# Altium schematic sheet 0150_PD TEST POINTS.SchDoc
size 848 x 558 mm
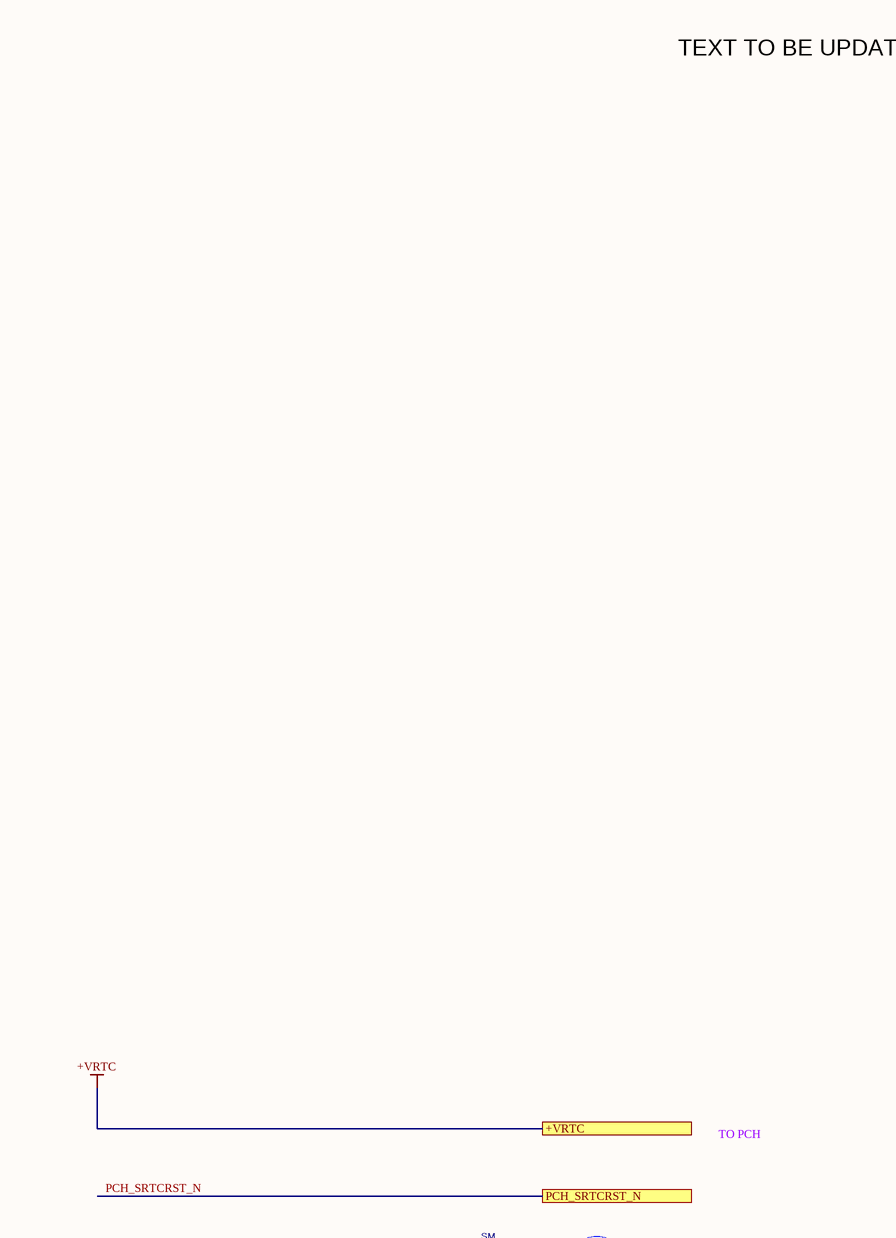
[diagram p0: 0150_PD TEST POINTS.SchDoc, top left]
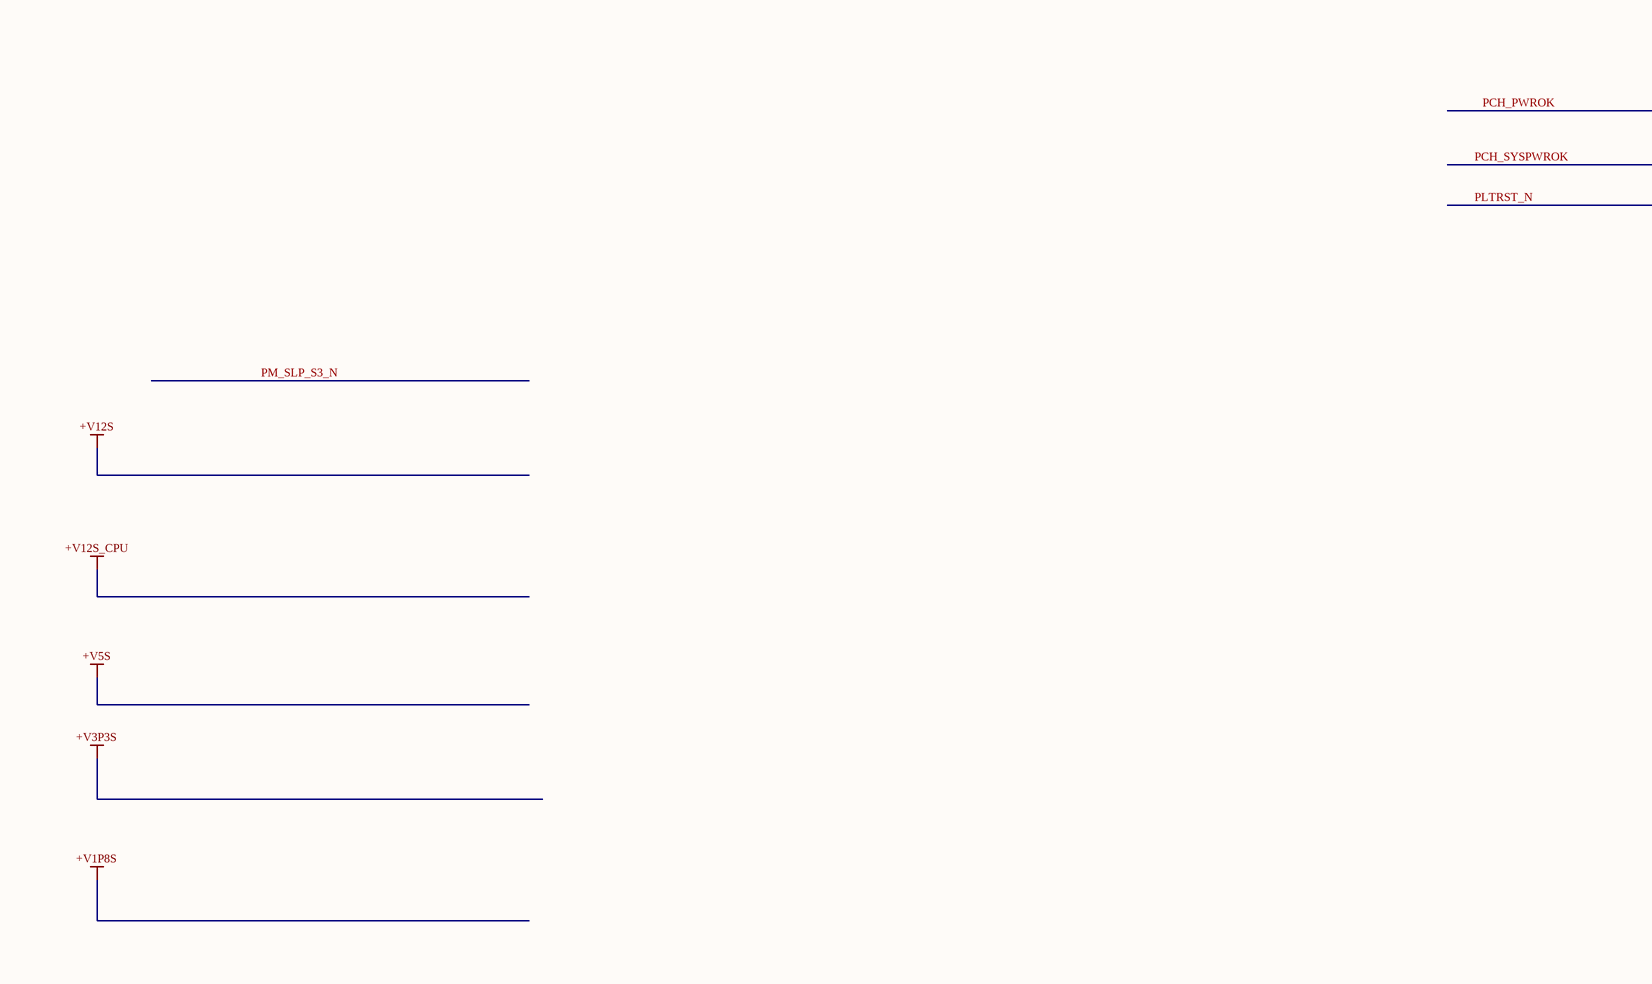
[diagram p1: 0150_PD TEST POINTS.SchDoc, top right]
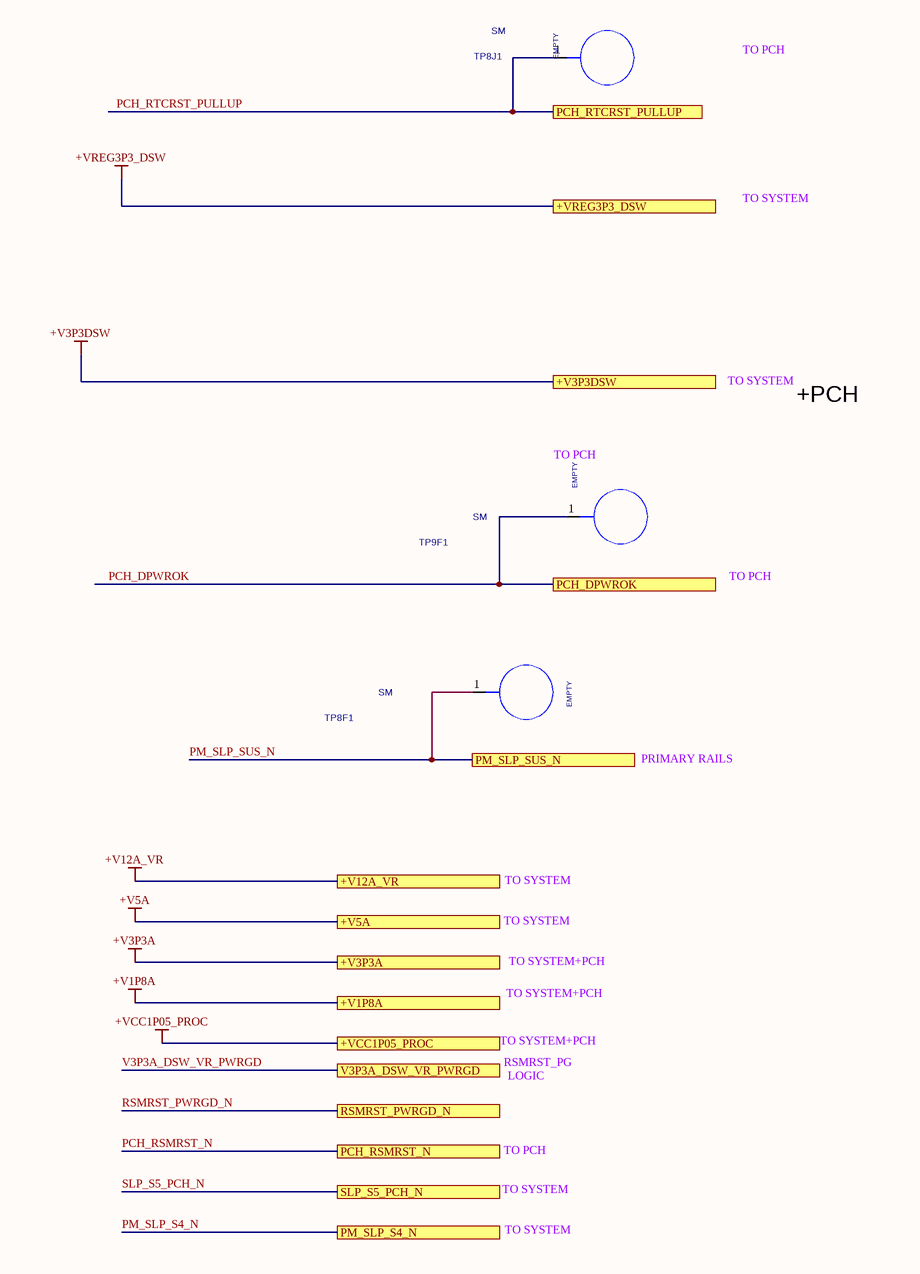
[diagram p2: 0150_PD TEST POINTS.SchDoc, bottom left]
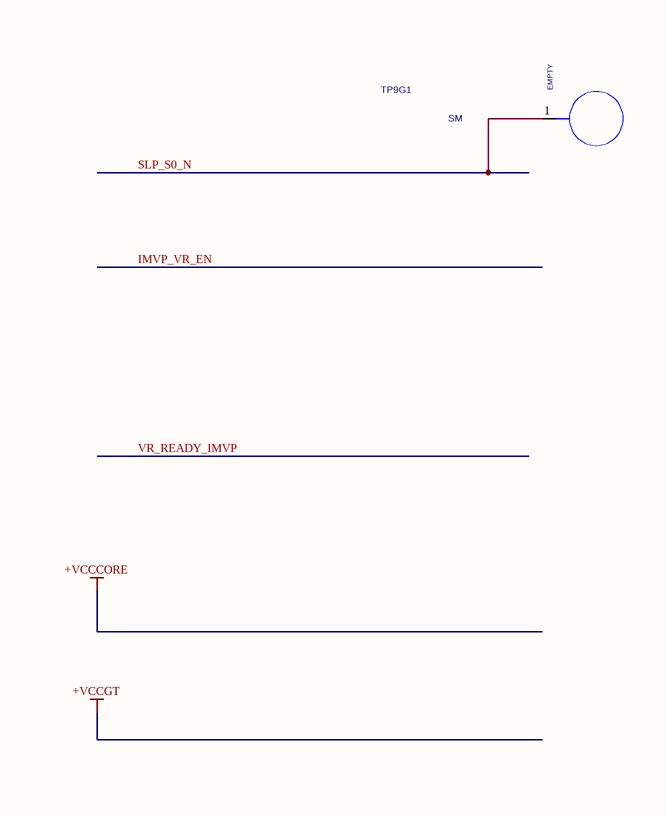
[diagram p3: 0150_PD TEST POINTS.SchDoc, bottom right]

## Parts
TP8F1  MATERIAL: EMPTY  PACK_TYPE: SM  [TPS16]  (hidden comment: TP20)
TP8J1  MATERIAL: EMPTY  PACK_TYPE: SM  [TPS16]  (hidden comment: TP20)
TP9F1  MATERIAL: EMPTY  PACK_TYPE: SM  [TPS16]  (hidden comment: TP20)
TP9G1  MATERIAL: EMPTY  PACK_TYPE: SM  [TPS16]  (hidden comment: TP20)

## Ports
+V1P8A, +V3P3A, +V3P3DSW, +V5A, +V12A_VR, +VCC1P05_PROC, +VREG3P3_DSW, +VRTC, PCH_DPWROK, PCH_RSMRST_N, PCH_RTCRST_PULLUP, PCH_SRTCRST_N, PM_SLP_S4_N, PM_SLP_SUS_N, RSMRST_PWRGD_N, SLP_S5_PCH_N, V3P3A_DSW_VR_PWRGD

## Nets
+V1P8A: port +V1P8A
+V3P3A: port +V3P3A
+V3P3DSW: port +V3P3DSW
+V5A: port +V5A
+V12A_VR: port +V12A_VR
+VCC1P05_PROC: port +VCC1P05_PROC
+VREG3P3_DSW: port +VREG3P3_DSW
+VRTC: port +VRTC
PCH_DPWROK: TP9F1.1(TP) ; port PCH_DPWROK
PCH_RSMRST_N: port PCH_RSMRST_N
PCH_RTCRST_PULLUP: TP8J1.1(TP) ; port PCH_RTCRST_PULLUP
PCH_SRTCRST_N: port PCH_SRTCRST_N
PM_SLP_S4_N: port PM_SLP_S4_N
PM_SLP_SUS_N: TP8F1.1(TP) ; port PM_SLP_SUS_N
RSMRST_PWRGD_N: port RSMRST_PWRGD_N
SLP_S0_N: TP9G1.1(TP)
SLP_S5_PCH_N: port SLP_S5_PCH_N
V3P3A_DSW_VR_PWRGD: port V3P3A_DSW_VR_PWRGD

## Notes on the sheet
- TEXT TO BE UPDATED
- TO PCH
- TO SYSTEM
- +PCH
- PRIMARY RAILS
- TO SYSTEM+PCH
- RSMRST_PG
- LOGIC
- TO EC

## Library data of the parts
TP8F1 = TP#1: PART_NUMBER: NA_TPS16; CHIPS_PART_NAME: TP; CDS_PHYS_PART_NAME: DEBUG_PAD_TP-TP20,TP"; CDS_PART_NAME: TP_SM-NA_TPS16,EMPTY,TPS16,LPDB,GENERIC; CDS_LMAN_SYM_OUTLINE: -50,50,50,-50; OriginalSymbolOrigin: (-50,75); XY: (3950,2700); VER: 3; ROT: 1; PHYS_PAGE: 150; LOCATION: TP8F1; IP: GENERIC; FP_TECH: LPDB; DRAWING: @RVP1_ADL_SB_ADP_S_DDR5_SODIMM_2DPC_LIB.H55_DG2_2DPC(SCH_1):PAGE519; CDS_LIB: board_artifacts; PCB Footprint: TPS16; CDS_LOCATION: TP8F1; ASI_MODEL: NA_TPS16
TP8J1 = TP#1: PART_NUMBER: NA_TPS16; CHIPS_PART_NAME: TP; CDS_PHYS_PART_NAME: DEBUG_PAD_TP-TP20,TP"; CDS_PART_NAME: TP_SM-NA_TPS16,EMPTY,TPS16,LPDB,GENERIC; CDS_LMAN_SYM_OUTLINE: -50,50,50,-50; OriginalSymbolOrigin: (-50,75); XY: (4000,3800); VER: 3; ROT: 1; PHYS_PAGE: 150; LOCATION: TP8J1; IP: GENERIC; FP_TECH: LPDB; DRAWING: @RVP1_ADL_SB_ADP_S_DDR5_SODIMM_2DPC_LIB.H55_DG2_2DPC(SCH_1):PAGE519; CDS_LIB: board_artifacts; PCB Footprint: TPS16; CDS_LOCATION: TP8J1; ASI_MODEL: NA_TPS16
TP9F1 = TP#1: PART_NUMBER: NA_TPS16; CHIPS_PART_NAME: TP; CDS_PHYS_PART_NAME: DEBUG_PAD_TP-TP20,TP"; CDS_PART_NAME: TP_SM-NA_TPS16,EMPTY,TPS16,LPDB,GENERIC; CDS_LMAN_SYM_OUTLINE: -50,50,50,-50; OriginalSymbolOrigin: (-50,75); XY: (3975,3000); VER: 3; ROT: 1; PHYS_PAGE: 150; LOCATION: TP9F1; IP: GENERIC; FP_TECH: LPDB; DRAWING: @RVP1_ADL_SB_ADP_S_DDR5_SODIMM_2DPC_LIB.H55_DG2_2DPC(SCH_1):PAGE519; CDS_LIB: board_artifacts; PCB Footprint: TPS16; CDS_LOCATION: TP9F1; ASI_MODEL: NA_TPS16
TP9G1 = TP#1: PART_NUMBER: NA_TPS16; CHIPS_PART_NAME: TP; CDS_PHYS_PART_NAME: TP_SM-NA_TPS16,EMPTY,TPS16,LPDB,GENERIC; CDS_LMAN_SYM_OUTLINE: -50,50,50,-50; OriginalSymbolOrigin: (-50,75); XY: (6800,1375); VER: 3; ROT: 1; PHYS_PAGE: 150; LOCATION: TP9G1; IP: GENERIC; FP_TECH: LPDB; DRAWING: @RVP1_ADL_SB_ADP_S_DDR5_SODIMM_2DPC_LIB.H55_DG2_2DPC(SCH_1):PAGE519; CDS_LIB: board_artifacts; PCB Footprint: TPS16; CDS_PART_NAME: TP_SM-NA_TPS16,EMPTY,TPS16,LPDB,GENERIC; CDS_LOCATION: TP9G1; ASI_MODEL: NA_TPS16